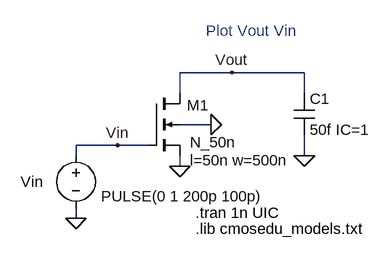
[diagram p0: schematic Fig10_12_NMOS_short.asc]
Fig10_12_NMOS_short.asc, the LTspice schematic file:
Version 4
SHEET 1 1136 680
WIRE 288 208 288 192
WIRE 288 304 288 288
WIRE 352 192 288 192
WIRE 400 192 352 192
WIRE 448 112 448 80
WIRE 448 224 448 208
WIRE 496 160 448 160
WIRE 528 80 448 80
WIRE 640 80 528 80
WIRE 640 112 640 80
WIRE 640 208 640 176
FLAG 288 304 0
FLAG 448 224 0
FLAG 640 208 0
FLAG 496 160 0
FLAG 528 80 Vout
FLAG 352 192 Vin
SYMBOL nmos4 400 112 R0
WINDOW 0 59 18 Left 0
WINDOW 3 64 75 Left 0
WINDOW 123 64 103 Left 0
SYMATTR InstName M1
SYMATTR Value N_50n
SYMATTR Value2 l=50n w=500n
SYMBOL voltage 288 192 R0
WINDOW 0 -85 56 Left 0
WINDOW 3 39 78 Left 0
WINDOW 123 0 0 Left 0
WINDOW 39 0 0 Left 0
SYMATTR InstName Vin
SYMATTR Value PULSE(0 1 200p 100p)
SYMBOL cap 624 112 R0
SYMATTR InstName C1
SYMATTR Value 50f IC=1
TEXT 472 296 Left 0 !.tran 1n UIC
TEXT 472 320 Left 0 !.lib cmosedu_models.txt
TEXT 488 16 Left 0 ;Plot Vout Vin

The netlist it stands for:
* Fig10_12_NMOS_short.asc
M1 Vout Vin 0 0 N_50n l=50n w=500n
Vin Vin 0 PULSE(0 1 200p 100p)
C1 Vout 0 50f IC=1
.model NMOS NMOS
.model PMOS PMOS
.lib standard.mos
.tran 1n UIC
.lib cmosedu_models.txt
* Plot Vout Vin
.backanno
.end